# EasyEDA schematic SCH_metroscope.json
TITLE: Sheet_1; REV: 1.0; Date: 2025-08-018; Sheet: 1/1; Drawn By: smirzaunsu
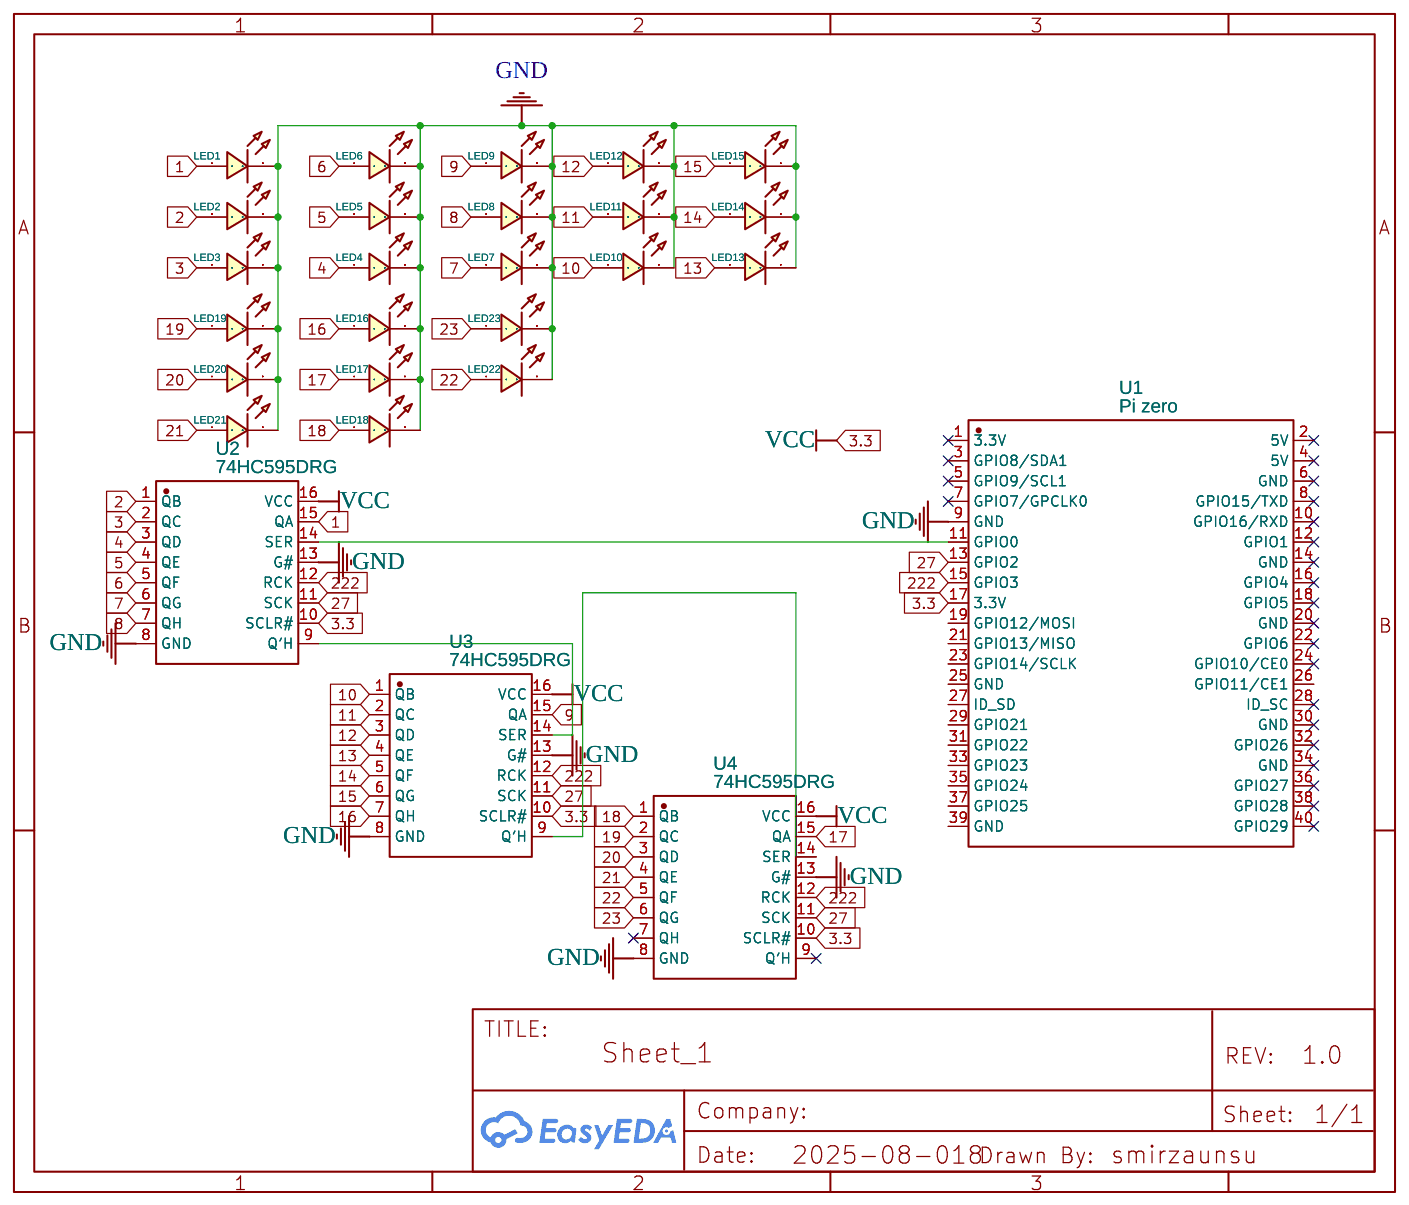
[diagram p0: schematic sheet]

## Parts
LED1  LED-0603_R  [LED0603_RED]
LED2  LED-0603_R  [LED0603_RED]
LED3  LED-0603_R  [LED0603_RED]
LED4  LED-0603_R  [LED0603_RED]
LED5  LED-0603_R  [LED0603_RED]
LED6  LED-0603_R  [LED0603_RED]
LED7  LED-0603_R  [LED0603_RED]
LED8  LED-0603_R  [LED0603_RED]
LED9  LED-0603_R  [LED0603_RED]
LED10  LED-0603_R  [LED0603_RED]
LED11  LED-0603_R  [LED0603_RED]
LED12  LED-0603_R  [LED0603_RED]
LED13  LED-0603_R  [LED0603_RED]
LED14  LED-0603_R  [LED0603_RED]
LED15  LED-0603_R  [LED0603_RED]
LED16  LED-0603_R  [LED0603_RED]
LED17  LED-0603_R  [LED0603_RED]
LED18  LED-0603_R  [LED0603_RED]
LED19  LED-0603_R  [LED0603_RED]
LED20  LED-0603_R  [LED0603_RED]
LED21  LED-0603_R  [LED0603_RED]
LED22  LED-0603_R  [LED0603_RED]
LED23  LED-0603_R  [LED0603_RED]
U1  Pi zero  [PIZEROFP]
U2  74HC595DRG  [SOP-16_L9.9-W3.9-P1.27-LS6.0-BL]
U3  74HC595DRG  [SOP-16_L9.9-W3.9-P1.27-LS6.0-BL]
U4  74HC595DRG  [SOP-16_L9.9-W3.9-P1.27-LS6.0-BL]

## Library data of the parts
LED1-LED23 = LED-0603_R: Manufacturer: EVERLIGHT(台湾亿光); Manufacturer Part: 19-217/R6C-AL1M2VY/3T; Supplier Part: C72044; Supplier: LCSC; Contributor: LCEDA_01
U1 = Pi zero: Contributor: smirzaunsu
U2-U4 = 74HC595DRG: Supplier: LCSC; Supplier Part: C42433274; Manufacturer: HGC(深圳汉芯); Contributor: lcsc

## Nets
GND: LED1.2 LED2.2 LED3.2 LED4.2 LED5.2 LED6.2 LED7.2 LED8.2 LED9.2 LED10.2 LED11.2 LED12.2 LED13.2 LED14.2 LED15.2 LED16.2 LED17.2 LED18.2 LED19.2 LED20.2 LED21.2 LED22.2 LED23.2 U1.9(GND) U2.8(GND) U2.13(G#) U3.8(GND) U3.13(G#) U4.8(GND) U4.13(G#)
1: LED1.1 U2.15(QA)
2: LED2.1 U2.1(QB)
3: LED3.1 U2.2(QC)
3.3: U1.17(3.3V) U2.10(SCLR#) U2.16(VCC) U3.10(SCLR#) U3.16(VCC) U4.10(SCLR#) U4.16(VCC)
4: LED4.1 U2.3(QD)
5: LED5.1 U2.4(QE)
6: LED6.1 U2.5(QF)
7: LED7.1 U2.6(QG)
8: LED8.1 U2.7(QH)
9: LED9.1 U3.15(QA)
10: LED10.1 U3.1(QB)
11: LED11.1 U3.2(QC)
12: LED12.1 U3.3(QD)
13: LED13.1 U3.4(QE)
14: LED14.1 U3.5(QF)
15: LED15.1 U3.6(QG)
16: LED16.1 U3.7(QH)
17: LED17.1 U4.15(QA)
18: LED18.1 U4.1(QB)
19: LED19.1 U4.2(QC)
20: LED20.1 U4.3(QD)
21: LED21.1 U4.4(QE)
22: LED22.1 U4.5(QF)
23: LED23.1 U4.6(QG)
27: U1.13(GPIO2) U2.11(SCK) U3.11(SCK) U4.11(SCK)
222: U1.15(GPIO3) U2.12(RCK) U3.12(RCK) U4.12(RCK)
Net-(U1-11): U1.11(GPIO0) U2.14(SER)
Net-(U2-9): U2.9(Q′H) U3.14(SER)
Net-(U3-9): U3.9(Q′H) U4.14(SER)

Not connected (* = marked no-connect by the designer): U1 1(3.3V)* 2(5V)* 3(GPIO8/SDA1)* 4(5V)* 5(GPIO9/SCL1)* 6(GND)* 7(GPIO7/GPCLK0)* 8(GPIO15/TXD)* 10(GPIO16/RXD)* 12(GPIO1)* 14(GND)* 16(GPIO4)* 18(GPIO5)* 19(GPIO12/MOSI) 20(GND)* 21(GPIO13/MISO) 22(GPIO6)* 23(GPIO14/SCLK) 24(GPIO10/CE0)* 25(GND) 26(GPIO11/CE1) 27(ID_SD) 28(ID_SC)* 29(GPIO21) 30(GND)* 31(GPIO22) 32(GPIO26)* 33(GPIO23) 34(GND)* 35(GPIO24) 36(GPIO27)* 37(GPIO25) 38(GPIO28)* 39(GND) 40(GPIO29)*; U4 7(QH)* 9(Q′H)*
